# Altium schematic sheet Sheet1.SchDoc
size B; SheetNumber: 1; SheetTotal: 1
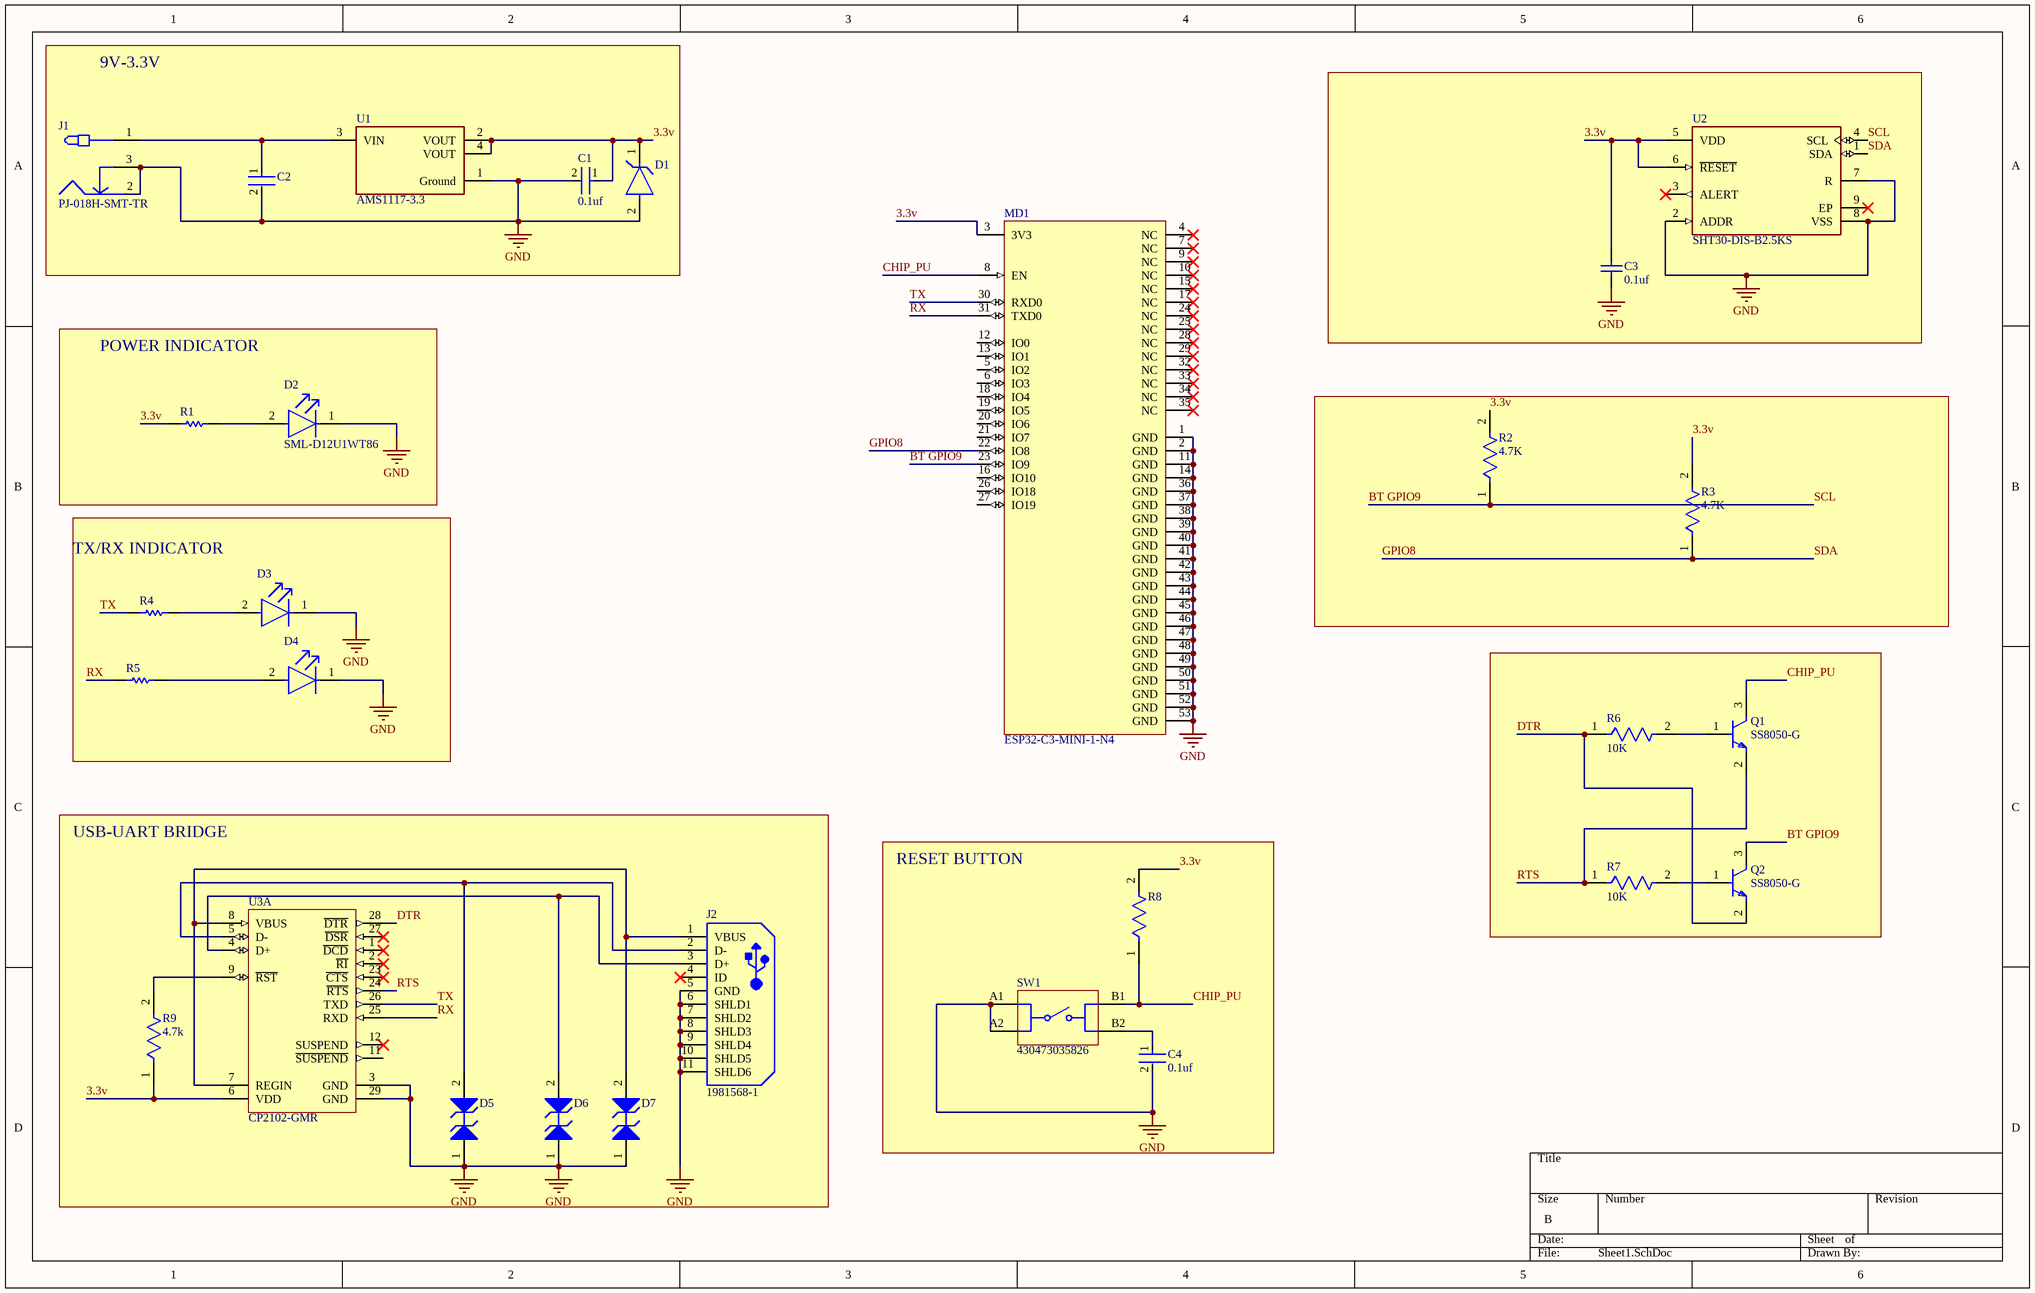
[diagram p0: Sheet1.SchDoc]

## Parts
C1  0.1uf  [FP-0402B104K160CT-IPC_C]
C2  0402B104K160CT  [FP-0402B104K160CT-IPC_C]  (value not drawn)
C3  0.1uf  [CAPC1608X87X35ML15T15]
C4  0.1uf  [FP-0402B104K160CT-IPC_C]
D1  JANTX1N746AUR-1  [FP-DO-213AA-MFG]  (value not drawn)
D2  SML-D12U1WT86  [FP-SML-D12-MFG]
D3  SML-D12U1WT86  [FP-SML-D12-MFG]  (value not drawn)
D4  SML-D12U1WT86  [FP-SML-D12-MFG]  (value not drawn)
D5  ESD9B5.0ST5G  [ONSC-SOD-923-2-514AB-01_V]  (value not drawn)
D6  ESD9B5.0ST5G  [ONSC-SOD-923-2-514AB-01_V]  (value not drawn)
D7  ESD9B5.0ST5G  [ONSC-SOD-923-2-514AB-01_V]  (value not drawn)
J1  PJ-018H-SMT-TR  [FP-PJ-018H-SMT-TR-MFG]
J2  1981568-1  [TECO-1981568-5_V]
MD1  ESP32-C3-MINI-1-N4  [FP-ESP32-C3-MINI-1-N4-MFG]
Q1  SS8050-G  [FP-SS8050-G-MFG]
Q2  SS8050-G  [FP-SS8050-G-MFG]
R1  RL0510S-R15-F  [RESC1005X45X15LL05T10]  (value not drawn)
R2  4.7K  [FP-TFCR0402-IPC_A]
R3  4.7K  [FP-TFCR0402-IPC_A]
R4  (no value)  [RESC1005X45X15LL05T10]
R5  RL0510S-R15-F  [RESC1005X45X15LL05T10]  (value not drawn)
R6  10K  [FP-CRCW0402-C-e3-IPC_C]
R7  10K  [FP-CRCW0402-C-e3-IPC_C]
R8  CRGCQ0402J10K  [FP-CRGCQ0402-IPC_C]  (value not drawn)
R9  4.7k  [FP-RC0402-0_4-MFG]
SW1  430473035826  [430473035826]
U1  AMS1117-3.3  [FP-AMS1117-IPC_C]
U2  SHT30-DIS-B2.5KS  [FP-SHT30-DIS-B2_5KS-MFG]
U3  CP2102-GMR  [SLAB-QFN-28-3125x3125TP_M]  (part A of 2)

## Blocks framed on the sheet
9V-3.3V: C1 C2 D1 J1 U1
POWER INDICATOR: D2 R1
TX/RX INDICATOR: D3 D4 R4 R5
USB-UART BRIDGE: D5-D7 J2 R9 U3
RESET BUTTON: C4 R8 SW1

## Nets
GND: C1.2 C2.2 C3.1 C4.2 D1.2(A) D2.1(C) D3.1(C) D4.1(C) D5.1(A1) D6.1(A1) D7.1(A1) J1.2 J1.3 J2.5(GND) J2.6(SHLD1) J2.7(SHLD2) J2.8(SHLD3) J2.9(SHLD4) J2.10(SHLD5) J2.11(SHLD6) MD1.1(GND) MD1.2(GND) MD1.11(GND) MD1.14(GND) MD1.36(GND) MD1.37(GND) MD1.38(GND) MD1.39(GND) MD1.40(GND) MD1.41(GND) MD1.42(GND) MD1.43(GND) MD1.44(GND) MD1.45(GND) MD1.46(GND) MD1.47(GND) MD1.48(GND) MD1.49(GND) MD1.50(GND) MD1.51(GND) MD1.52(GND) MD1.53(GND) SW1.A1 SW1.A2 U1.1(Ground) U2.2(ADDR) U2.7(R) U2.8(VSS) U3.3(GND) U3.29(GND)
3.3v: C1.1 C3.2 D1.1(C) MD1.3(3V3) R1.1 R2.2 R3.2 R8.2 R9.1 U1.2(VOUT) U1.4(VOUT) U2.5(VDD) U2.6(~{RESET}) U3.6(VDD)
BT GPIO9: MD1.23(IO9) Q2.3(C) R2.1 U2.4(SCL)  [also labelled SCL]
CHIP_PU: MD1.8(EN) Q1.3(C) R8.1 SW1.B1
DTR: Q2.2(E) R6.1 U3.28(~{DTR})
GPIO8: MD1.22(IO8) R3.1 U2.1(SDA)  [also labelled SDA]
RTS: Q1.2(E) R7.1 U3.24(~{RTS})
RX: MD1.31(TXD0) R5.1 U3.25(RXD)
TX: MD1.30(RXD0) R4.1 U3.26(TXD)
NetC2_1: C2.1 J1.1 U1.3(VIN)
NetC4_1: C4.1 SW1.B2
NetD2_2: D2.2(A) R1.2
NetD3_2: D3.2(A) R4.2
NetD4_2: D4.2(A) R5.2
NetD5_2: D5.2(A2) J2.2(D-) U3.5(D-)
NetD6_2: D6.2(A2) J2.3(D+) U3.4(D+)
NetD7_2: D7.2(A2) J2.1(VBUS) U3.7(REGIN) U3.8(VBUS)
NetQ1_1: Q1.1(B) R6.2
NetQ2_1: Q2.1(B) R7.2
NetR9_2: R9.2 U3.9(~{RST})

Not connected (* = marked no-connect by the designer): J2 4(ID)*; MD1 4(NC)* 5(IO2) 6(IO3) 7(NC)* 9(NC)* 10(NC)* 12(IO0) 13(IO1) 15(NC)* 16(IO10) 17(NC)* 18(IO4) 19(IO5) 20(IO6) 21(IO7) 24(NC)* 25(NC)* 26(IO18) 27(IO19) 28(NC)* 29(NC)* 32(NC)* 33(NC)* 34(NC)* 35(NC)*; U2 3(ALERT)* 9(EP)*; U3 1(~{DCD})* 2(~{RI})* 11(~{SUSPEND}) 12(SUSPEND)* 23(~{CTS})* 27(~{DSR})*

## Library data of the parts
C1 C2 C4 = CMP-45632-000002-1: CAP CER 0.1UF 16V X7R 0402; Capacitance: 100nF; Tolerance: 10%; Case Code (Imperial): 0402; Length: 1mm; Radiation Hardening: No; Case Code (Metric): 1005; Max Operating Temperature: 125°C; Voltage Rating: 16V; Voltage Rating (DC): 16V; Dielectric: X7R; RoHS Compliant: Yes; Packaging: Tape and Reel; Lead Free: Lead Free; Depth: 0.5mm; Case/Package: 0402; Min Operating Temperature: -55°C; Series: -
C3 = CMP-2006-03295-1: Part Number: C0603T104K3RCLTU; Manufacturer: Kemet
D1 = CMP-00252-101805919-1: JANTX1N746AUR-1 JANTX Series 3.3 V ±5 % 500 mW Through Hole Zener Diode - DO-213AA; Test Current: 20mA; Element Configuration: Single; Power Dissipation: 500mW; Zener Voltage: 3.3V; Max Reverse Leakage Current: 10µA; Voltage Tolerance: 5%; Min Operating Temperature: -65°C; Lead Free: Contains Lead; Max Operating Temperature: 175°C; Number of Pins: 2; NexarPartId: 101805919; Lifecycle Status: Production; RoHS: Compliant; Radiation Hardening: No; Packaging: Bulk; Mount: Surface Mount; Schedule B: 8541100050; Max Power Dissipation: 500mW
D2-D4 = CMP-08952-000009-1: LED RED DIFFUSED 1608 SMD; Manufacturer: Rohm; Led Orientation: Top View; Power Dissipation: 54mW; Forward Current: 20mA; Wavelength: 620nm; Reverse Voltage: 5V; Luminous Intensity: 63mcd; Forward Voltage: 2.2V; Mouser Description: SML-D12 Series Red 0603 Diffused 63 mcd 2.2 V Surface Mount LED; Temperature: -40°C to +85°C; Device Class L2: LEDs; Lead Free: Yes; Automotive: No; Octopart: https://octopart.com/sml-d12u1wt86-rohm-70850259; RoHS: TRUE; Colour: Red; Digikey Description: LED RED DIFFUSED 1608 SMD; Package: SML-D12; Device Class L1: Optoelectronics; Category: Diode; Temperature Range High: +85°C; Height: 0.65mm; ComponentLink2Description: Datasheet; Temperature Range Low: -40°C; ComponentLink2URL: https://www.rohm.com/datasheet/SML-D12U1W/sml-d12x1-e; Manufacturer Part Number: SML-D12U1WT86; Device Class L3: unset
D5-D7 = CMP-1063-00119-1: Transient Voltage Suppressor, Micro-Packaged Diode for ESD Protection, 2-Pin SOD-923, Pb-Free, Tape and Reel; Manufacturer: On Semiconductor; Number of Lines: 1; Direction: Bidirectional; V(BR) Min (V): 5.8; VRWM Max (V): 5; Packing: Tape and Reel; PackageDescription: 2-Pin SOD, Body 0.8 x 0.6 mm; IR Max (uA): 1; ComponentLink3Description: Package Specification; PartNumber: ESD9B5.0ST5G; ComponentLink1URL: http://www.onsemi.com/; RoHS: Pb-Free; Mounting Technology: Surface Mount; DatasheetVersion: Rev. 2; ComponentLink2URL: http://www.onsemi.cn/pub_link/Collateral/ESD9B-D.PDF; ComponentLink3URL: http://www.onsemi.com/pub_link/Collateral/514AB.PDF; PackageReference: SOD-923-2-514AB-01; PackageVersion: Rev. C, 03/2011; ComponentLink1Description: Manufacturer URL; ComponentLink2Description: Datasheet
J1 = CMP-14830-000007-1: CONN PWR JACK 1.7X4MM SOLDER; Manufacturer: CUI; Current Rating: 5A; Conn Orientation: Right Angle; Standoff Height: 0.1mm; Conn Gender: Male; Number Of Contacts: 1; Voltage Rating: 24V; Device Class L3: unset; Digikey Description: CONN PWR JACK 1.7X4MM SOLDER; Mouser Description: DC Power Connectors Power Jacks; Category: Conn; Temperature: -25°C to +85°C; Temperature Range High: +85°C; Device Class L2: Power Connectors; Package: 0; Octopart: https://octopart.com/pj-018h-smt-tr-cui-25947163; Automotive: No; Manufacturer Part Number: PJ-018H-SMT-TR; Device Class L1: Connectors; Height: 5.6mm; RoHS: TRUE; Temperature Range Low: -25°C; Contact Material: Nickel,Silver; Lead Free: Yes; ComponentLink2Description: Datasheet; ComponentLink2URL: https://www.cuidevices.com/product/resource/pj-018h-smt-tr.pdf
J2 = CMP-2000-05408-1: Micro USB Receptacle Standard Type B Assy, 5-Pin SMD, RoHS, Tape and Reel; Manufacturer: TE Connectivity; Body Orientation: RightAngle; Number of Ports: 1Port; Number of Contacts: 5POS; Gender: RCP; Voltage Rating Max: 30VAC; Product Depth (mm): 5.6mm; Pitch (mm): 0.65mm; Current Rating (Max): 1/ContactA; Product Length (mm): 8mm; Product Height (mm): 3mm; Operating Temperature Max Deg. C: 85C; Datasheet URL: http://www.mouser.com/ds/2/418/NG_CD_1981568_E2-621296.pdf; Termination Method: Solder; Number of Terminals: 5; Operating Temp Range: -55Cto85C; Mounting Style: SurfaceMount; Manufacturer URL: http://www.te.com/; Contact Material: CopperAlloy; Packaging: TapeandReel; Datasheet Version: Rev. E2, 08/2015; Operating Temperature Min Deg. C: -55C; Housing Material: Thermoplastic; Type: MicroUSB; Contact Plating: GoldOverNickel
MD1 = CMP-10700-116589975-1: Multiprotocol Modules SMD module, ESP32-C3FN4, PCB antenna, -40 C +85 C; Max Frequency: 2.484GHz; Min Supply Voltage: 3V; Current - Transmitting: 350mA; Interface: SPI; Data Rate: 150Mbps; Max Supply Voltage: 3.6V; Number of GPIO: 13; Current - Receiving: 84mA; Min Operating Temperature: -40°C; Height: 2.55mm; Ambient Temperature Range High: 85°C; Max Operating Temperature: 85°C
Q1 Q2 = CMP-20235-000001-1: NPN TRANSISTOR 1.5A 40V SOT-23 R; Transition Frequency: 100MHz; Max Breakdown Voltage: 25V; Collector Emitter Voltage (VCEO): 400mV; Max Power Dissipation: 300mW; Max Collector Current: 1.5A; Case/Package: TO-236-3; Packaging: Tape and Reel; RoHS Compliant: Yes; Mount: Surface Mount; Collector Emitter Breakdown Voltage: 25V
R1 R5 = CMP-2002-01742-1: Manufacturer: Susumu; Part Number: RL0510S-R15-F
R2 R3 = CMP-250906-194630-1: RES Thin Film,  4.7kΩ, 0.5%, 0.063W, 25ppm/°C, 0402
R4 = CMP-2002-01742-1: Part Number: RL0510S-R15-F; Manufacturer: Susumu
R6 R7 = CMP-02407-012085-1: RES 10K OHM 1% 1/16W 0402; Temperature Coefficient: 100ppm/°C; Power Rating: 62.5mW; Resistance: 10kR; Lead Free: Lead Free; Max Operating Temperature: 155°C; RoHS Compliant: Yes; Mount: Surface Mount; Min Operating Temperature: -55°C; Termination: Wraparound; Length: 1mm; Resistor Type: Thick Film; Contact Plating: Tin; Tolerance: 1%; Case/Package: Molded
R8 = CMP-03211-008081-1: CRGCQ 0402 10K 5%; Manufacturer: TE Connectivity; Power Rating: 0.0625W; Tolerance: 0.05; Voltage Rating: 50V; Temperature Coefficient: ±100ppm/°C; Resistance: 10KΩ; Value: 10KΩ; RoHS: TRUE; Octopart: https://octopart.com/crgcq0402j10k-te+connectivity-91017993; ComponentLink2URL: https://www.te.com/commerce/DocumentDelivery/DDEController?Action=showdoc&DocId=Data+Sheet%7F1773204-3%7F1%7Fpdf%7FEnglish%7FENG_DS_1773204-3_1.pdf%7F4-2176347-923; Package: CRGCQ0402; Mouser Description: Res Thick Film 0402 10K Ohm 5% 0.063W(1/16W) ±100ppm/C Pad SMD Automotive T/R; Temperature Range High: +155°C; Composition: Thick Film; Automotive: Yes; Category: Res; Temperature Range Low: -55°C; Height: 0.4mm; Device Class L3: Chip SMD Resistors; Device Class L2: Resistors; Digikey Description: CRGCQ 0402 10K 5%; Ambient Temperature Range High: +70°C; Device Class L1: Passive Components; Lead Free: Yes; ComponentLink2Description: Datasheet; Manufacturer Part Number: CRGCQ0402J10K; Temperature: -55°C to +155°C; Series: CRGCQ; Ipc Land Pattern Name: RESC10050X35
R9 = CMP-2002-08011-2: Tolerance: 5%; Power Rating: 63mW; Resistance: 4.7kΩ; Voltage Rating: 50V; Temperature Coefficient: 100ppm/°C; Composition: Thick Film; Max Operating Temperature: 155°C; Case/Package: 0402; Depth: 500µm; Packaging: Tape & Reel; Number of Pins: 2; Schedule B: 8533210045, 8533210045; Case Code (Imperial): 0402; Termination: SMD/SMT; Military Standard: Not; Lead Free: Lead Free; Width: 500µm; REACH SVHC: No SVHC; Max Power Dissipation: 63mW; Voltage Rating (AC): 50V; Features: Moisture Resistant; Min Operating Temperature: -55°C; Number of Terminations: 2; RoHS: Compliant; Height: 350µm; Voltage Rating (DC): 50V; Length: 1mm
SW1 = CMP-1455-00006-3: Switch Tactile Spst-no 0.05A 12V; Throw Configuration: SPST; Switch Travel: 250µm; Actuator Material: Liquid Crystal Polymer, Polymer; Current Rating: 50mA; Insulation Resistance: 100MΩ; Illumination Type: Non-Illuminated; Switch Function: Off-Mom; Mechanical Life: 500kcycles; Voltage Rating: 12V; Max Operating Temperature: 85°C; Packaging: Tape and Reel; RoHS: Compliant; Height: 3.5mm; Contact Plating: Silver; Mount: Surface Mount; Min Operating Temperature: -40°C
U1 = CMP-209535-000001-1: LDO Voltage Regulators 1A, 3.3V; Manufacturer: Advanced Monolithic Systems; Dropout Voltage: 1.1V; Output Type: Fixed; Nominal Supply Current: 5mA; Max Power Dissipation: 1.2W; Max Supply Voltage: 15V; Number Of Outputs: 1; Standoff Height: 0.64mm; Max Junction Temp: +125°C; Height: 1.8mm; Package: AMS1117; Device Class L2: Power Management ICs; ComponentLink2Description: Datasheet; ComponentLink2URL: http://www.advanced-monolithic.com/pdf/ds1117.pdf; Category: IC; RoHS: TRUE; Automotive: No; Device Class L1: Integrated Circuits (ICs); Output Current: 1A; Device Class L3: Voltage Regulators - Linear; Temperature: -40°C to +125°C; Output Voltage: 3.3V; Manufacturer Part Number: AMS1117-3.3; Temperature Range Low: -40°C; Octopart: https://octopart.com/ams1117-3.3-advanced+monolithic+systems-25899300; Lead Free: Yes; Ipc Land Pattern Name: SOT229P700X180-4; Temperature Range High: +125°C
U2 = CMP-144040-000006-1: SENSOR HUMID/TEMP 5V I2C 3% SMD
U3 = CMP-2000-04924-1: Single-Chip USB to URAT Bridge, 3.3 V, -40 to 85 degC, 28-Pin QFN, RoHS, Tape and Reel; Manufacturer: Silicon Labs; Interface Circuit Standard 1: RS-232; Transmitter and Receiver FIFO Counter: No; Supply Current: 26mA; Operating Supply Voltage (Min): 3V; Operating Supply Voltage (Typ): 3.3V; Data Rate: 1000kbps; Operating Supply Voltage (Max): 3.6V; Number of Channels: 1; Package URL: http://www.silabs.com/Support%20Documents/TechnicalDocs/C8051T61x.pdf; Operating Temperature (Max): 85C; Datasheet URL: http://www.mouser.com/ds/2/368/CP2102-9-247052.pdf; Operating Temperature Classification: Industrial; Operating Temperature (Min): -40C; Package Description: 28-Pin Quad-Flat No-Leads Package, Body 5 x 5 mm, Pitch 0.5 mm; Manufacturer URL: http://www.silabs.com/; Rad Hardened: No; Package Reference: QFN-28; Pin Count: 28; Packaging: TapeandReel; Mounting: SurfaceMount; Package Type: QFNEP; Datasheet Version: Rev. 1.6, 12/2013